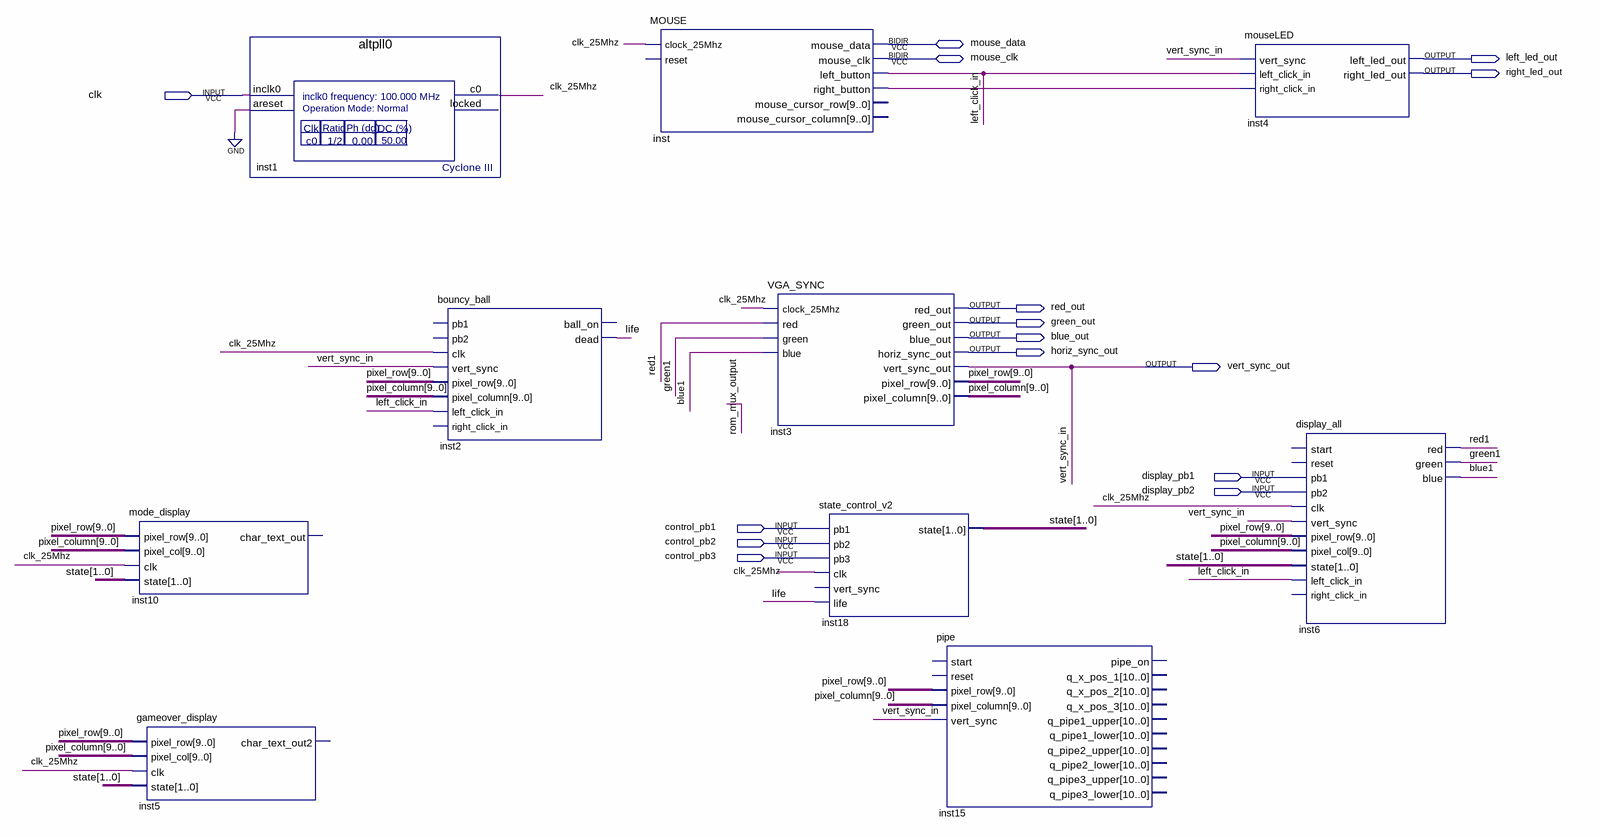
[diagram p0: schematic sheet]
// Quartus schematic FlappyBird_Mini_Project.bdf as structural Verilog: 10 symbols, 15 pins
module FlappyBird_Mini_Project (
  input  clk,
  input  display_pb1,
  input  display_pb2,
  input  control_pb1,
  input  control_pb2,
  input  control_pb3,
  inout  mouse_data,
  inout  mouse_clk,
  output left_led_out,
  output right_led_out,
  output red_out,
  output green_out,
  output blue_out,
  output horiz_sync_out,
  output vert_sync_out
);

  wire blue1, clk_25Mhz, green1, inst_right_button, left_click_in, life, red1;
  wire [1:0] state;
  wire [9:0] pixel_column, pixel_row;

  mode_display inst10 (
    .pixel_row(pixel_row), .pixel_col(pixel_column), .clk(clk_25Mhz), .state(state));  // open: char_text_out
  gameover_display inst5 (
    .pixel_row(pixel_row), .pixel_col(pixel_column), .clk(clk_25Mhz), .state(state));  // open: char_text_out2
  altpll0 inst1 (.inclk0(clk), .areset(1'b0), .c0(clk_25Mhz));  // open: locked
  bouncy_ball inst2 (
    .clk(clk_25Mhz), .vert_sync(vert_sync_out), .pixel_row(pixel_row), .pixel_column(pixel_column),
    .left_click_in(left_click_in), .dead(life));  // open: pb1, pb2, right_click_in, ball_on
  MOUSE inst (
    .clock_25Mhz(clk_25Mhz), .left_button(left_click_in), .right_button(inst_right_button),
    .mouse_data(mouse_data), .mouse_clk(mouse_clk));  // open: reset, mouse_cursor_row, mouse_cursor_column
  VGA_SYNC inst3 (
    .clock_25Mhz(clk_25Mhz), .red(red1), .green(green1), .blue(blue1), .red_out(red_out),
    .green_out(green_out), .blue_out(blue_out), .horiz_sync_out(horiz_sync_out),
    .vert_sync_out(vert_sync_out), .pixel_row(pixel_row), .pixel_column(pixel_column));
  state_control_v2 inst18 (
    .pb1(control_pb1), .pb2(control_pb2), .pb3(control_pb3), .clk(clk_25Mhz), .life(life), .state(state));  // open: vert_sync
  pipe inst15 (
    .pixel_row(pixel_row), .pixel_column(pixel_column), .vert_sync(vert_sync_out));  // open: start, reset, pipe_on, q_x_pos_1, q_x_pos_2, q_x_pos_3, q_pipe1_upper, q_pipe1_lower, q_pipe2_upper, q_pipe2_lower, q_pipe3_upper, q_pipe3_lower
  mouseLED inst4 (
    .vert_sync(vert_sync_out), .left_click_in(left_click_in), .right_click_in(inst_right_button),
    .left_led_out(left_led_out), .right_led_out(right_led_out));
  display_all inst6 (
    .pb1(display_pb1), .pb2(display_pb2), .clk(clk_25Mhz), .vert_sync(vert_sync_out), .pixel_row(pixel_row),
    .pixel_col(pixel_column), .state(state), .left_click_in(left_click_in), .red(red1), .green(green1),
    .blue(blue1));  // open: start, reset, right_click_in

  // Other names for the same wires on the sheet: vert_sync_in = vert_sync_out
endmodule
